# EasyEDA Pro project ProProject_Driver_STM32F405_2023-10-07.epro, board PCB1
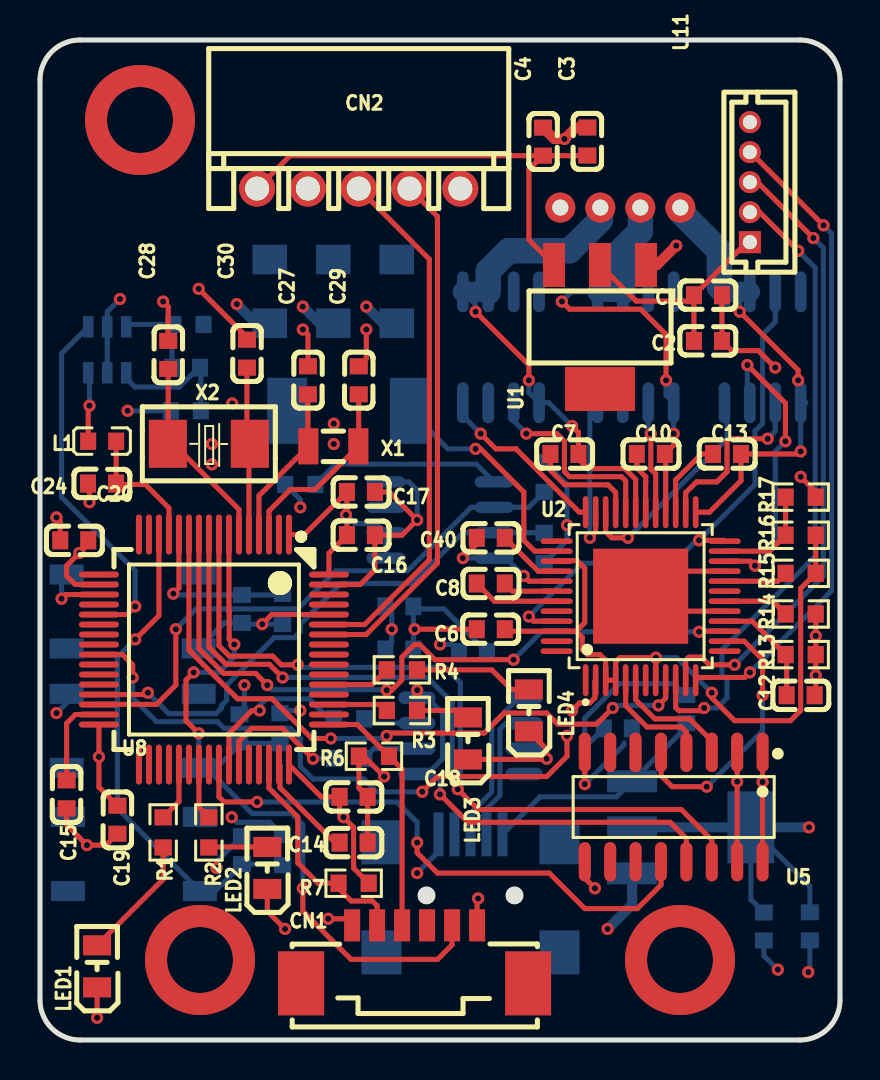
[diagram p4: board, top side]
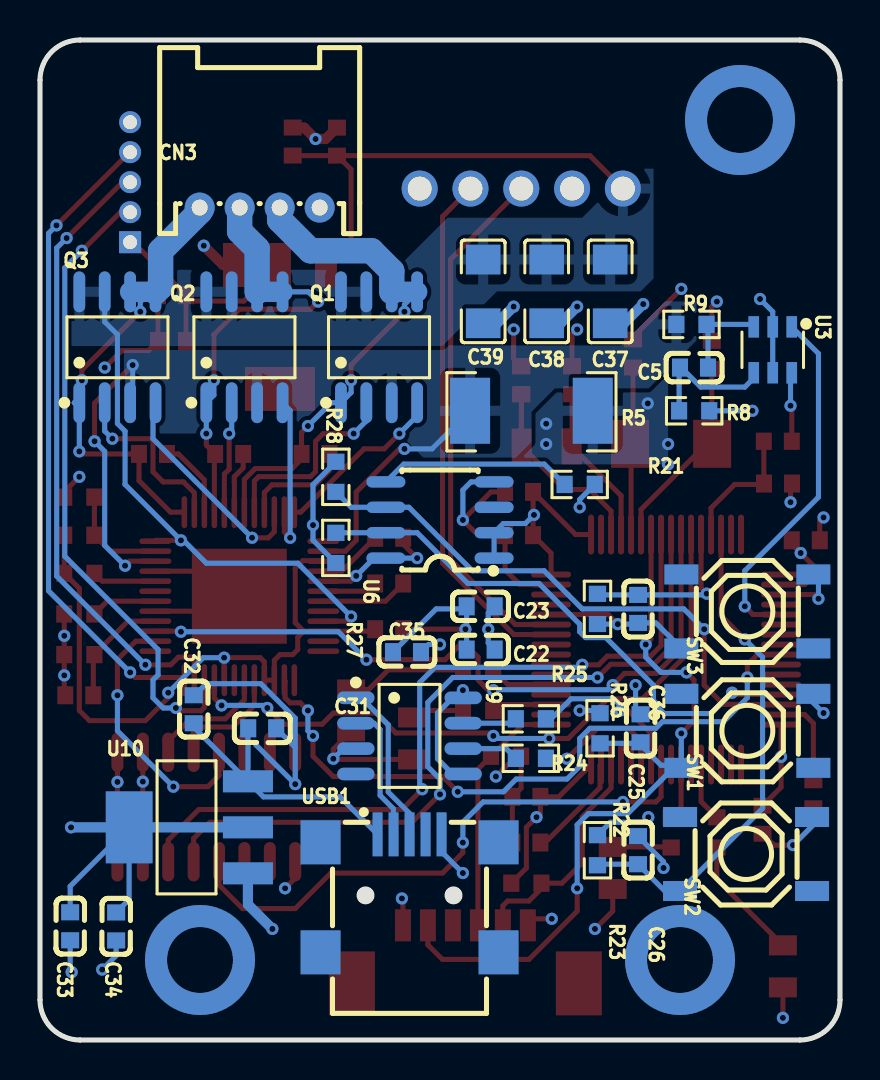
[diagram p5: board, bottom side, seen from below]

Outline 40 x 50 mm; copper layers: Top Layer, Inner1, Inner2, Bottom Layer. Coordinates in mm from the lower left corner of the outline.
Outline path: 0,48 0,2 arc(0.59,0.59) 2,0 38,0 arc(39.41,0.59) 40,2 40,48 arc(39.41,49.41) 38,50 2,50 arc(0.59,49.41) 0,48
Stack: Top Layer 0.035mm / Dielectric1 0.48mm PP er 4.5 / Inner1 0.035mm / Dielectric2 0.48mm FR4 er 4.5 / Inner2 0.035mm / Dielectric3 0.48mm PP er 4.5 / Bottom Layer 0.035mm

## Design rules (mm)
spacing safeClearance (default): track to track 0.152, other pairs 0.152 to 0.3
track width trackWidth (default): min 0.127, default 0.254, max 2.54
differential pair differentialPair (default): width min 0.127, default 0.254, max 2.54; gap min 0.152, default 0.152
via viaSize (default): diameter min 0.5, default 0.61, max 10; hole min 0.3, default 0.305, max 6
net GND uses copperRegion1
net VCC uses copperRegion1
net GND_CS uses copperRegion1
net +16V uses copperRegion1

## Placement (name value [footprint] x y rotation side)
C1  10uF  [C0603]  33.4 37.24 0 top
C2  100nF  [C0603]  33.4 34.95 0 top
C3  10uF  [C0603]  27.37 44.92 270 top
C4  100nF  [C0603]  25.15 44.92 270 top
C5  100nF  [C0603]  7.3 33.62 0 bottom
C6  1uF  [C0603]  22.54 20.54 0 top
C7  33nF  [C0603]  26.22 29.3 180 top
C8  470nF  [C0603]  22.54 22.83 180 top
C10  33nF  [C0603]  30.54 29.3 180 top
C12  1nF  [C0603]  38.03 17.24 180 top
C13  33nF  [C0603]  34.35 29.3 180 top
C14  100nF  [C0603]  15.68 9.87 180 top
C15  100nF  [C0603]  1.33 12.28 90 top
C16  100nF  [C0603]  16.05 25.24 180 top
C17  100nF  [C0603]  16.05 27.4 180 top
C18  100nF  [C0603]  15.68 12.16 180 top
C19  100nF  [C0603]  3.87 11.01 90 top
C20  100nF  [C0603]  1.71 24.98 180 top
C22  10uF  [C0603]  17.97 19.52 180 bottom
C23  100nF  [C0603]  17.97 21.68 180 bottom
C24  100nF  [C0603]  3.1 27.82 0 top
C25  100nF  [C0603]  9.97 15.59 270 bottom
C26  100nF  [C0603]  10.1 9.49 270 bottom
C27  20pF  [C0603]  13.4 32.98 270 top
C28  20pF  [C0603]  6.41 34.25 270 top
C29  20pF  [C0603]  15.94 32.98 270 top
C30  20pF  [C0603]  10.35 34.32 270 top
C31  100nF  [C0603]  28.89 15.59 0 bottom
C32  10uF  [C0603]  32.31 16.54 270 bottom
C33  100nF  [C0603]  38.49 5.69 270 bottom
C34  10uF  [C0603]  36.19 5.68 270 bottom
C35  100nF  [C0603]  21.65 19.4 180 bottom
C36  100nF  [C0603]  10.09 21.56 90 bottom
C37  10uF  [C1206]  11.49 37.43 90 bottom
C38  10uF  [C1206]  14.67 37.43 90 bottom
C39  10uF  [C1206]  17.84 37.43 90 bottom
C40  1uF  [C0603]  22.54 25.11 180 top
CN1  532610671  [CONN-SMD_6P-P1.25_53261-0671]  18.73 4.28 0 top
CN2  5264-5AWD米色  [CONN-TH_5P-P2.50_5264-5AWD]  15.94 43.27 0 top
CN3  HC-HY-4AW  [CONN-TH_4P-P2.00_HCTL_HC-HY-4AW]  29.02 41.62 180 bottom
L1  3.3uH  [L0603]  3.11 29.94 0 top
LED1  SZYY0805B  [LED0805-R-RD_BLUE]  2.85 3.68 90 top
LED2  SZYY0805B  [LED0805-R-RD_BLUE]  11.36 8.6 90 top
LED3  SZYY0805B  [LED0805-R-RD_BLUE]  21.4 15.08 90 top
LED4  SZYY0805B  [LED0805-R-RD_BLUE]  24.44 16.47 90 top
Q1  IRF8313PBF  [SOIC-8_L4.9-W3.9-P1.27-LS6.0-BL]  23.05 34.64 180 bottom
Q2  IRF8313PBF  [SOIC-8_L4.9-W3.9-P1.27-LS6.0-BL]  29.78 34.64 180 bottom
Q3  IRF8313PBF  [SOIC-8_L4.9-W3.9-P1.27-LS6.0-BL]  36.13 34.64 180 bottom
R1  1kΩ  [R0603]  6.16 10.38 90 top
R2  1kΩ  [R0603]  8.44 10.38 90 top
R3  1kΩ  [R0603]  18.09 16.47 180 top
R4  1kΩ  [R0603]  18.09 18.51 180 top
R5  25mΩ  [RES-SMD_L6.4-W3.2-R2512]  15.43 31.46 0 bottom
R6  10kΩ  [R0603]  16.7 14.19 0 top
R7  10kΩ  [R0603]  15.68 7.84 180 top
R8  10Ω  [R0603]  7.29 31.46 180 bottom
R9  10Ω  [R0603]  7.43 35.78 0 bottom
R13  47kΩ  [R0603]  38.03 19.27 180 top
R14  10kΩ  [R0603]  38.03 21.3 0 top
R15  100kΩ  [R0603]  38.03 23.33 180 top
R16  100kΩ  [R0603]  38.03 25.24 180 top
R17  10kΩ  [R0603]  38.03 27.14 180 top
R21  1kΩ  [R0603]  13.01 27.78 0 bottom
R22  10kΩ  [R0603]  12 15.59 90 bottom
R23  10kΩ  [R0603]  12.13 9.49 90 bottom
R24  1kΩ  [R0603]  15.46 14.09 0 bottom
R25  1kΩ  [R0603]  15.46 16.06 0 bottom
R26  10kΩ  [R0603]  12.13 21.56 90 bottom
R27  10kΩ  [R0603]  25.21 24.6 270 bottom
R28  10kΩ  [R0603]  25.21 28.16 90 bottom
SW1  TS-1187A-B-A-B  [SW-SMD_4P-L5.1-W5.1-P3.70-LS6.5-TL-2]  4.63 15.46 0 bottom
SW2  TS-1187A-B-A-B  [SW-SMD_4P-L5.1-W5.1-P3.70-LS6.5-TL-2]  4.7 9.3 0 bottom
SW3  TS-1187A-B-A-B  [SW-SMD_4P-L5.1-W5.1-P3.70-LS6.5-TL-2]  4.63 21.43 180 bottom
U1  AMS1117-5.0  [SOT-223_L6.7-W3.5-P2.30-BR]  28 35.65 90 top
U2  A3930KJPTR-T  [LQFP-48_L7.0-W7.0-P0.50-LS9.0-BL-EP]  30.03 22.19 0 top
U3  INA181A1IDBVR  [SOT-23-6_L2.9-W1.6-P0.95-LS2.8-TL]  3.36 34.51 270 bottom
U5  π131M31  [SOIC-16_L9.9-W3.9-P1.27-LS6.0-BL]  31.68 11.65 180 top
U6  AS5600-ASOT  [SOIC-8_L5.0-W4.0-P1.27-LS6.0-BL]  20 26 90 bottom
U8  STM32F405RGT6  [LQFP-64_L10.0-W10.0-P0.50-LS12.0-BL]  8.7 19.52 180 top
U9  CH340N  [SOP-8_L4.9-W3.9-P1.27-LS6.0-BL]  21.52 15.2 270 bottom
U10  AMS1117-3.3  [SOT-223-3_L6.5-W3.4-P2.30-LS7.0-BR]  32.57 10.63 180 bottom
U11  B5B-ZR-3.4(LF)(SN)  [CONN-TH_B5B-ZR-3.4-LF-SN]  35.49 42.89 270 top
USB1  MINI 5PTP  [MINI-USB-SMD_MINI-5PTP]  21.52 7.33 180 bottom
X1  32.768kHz  [FC-135R_L3.2-W1.5]  14.67 29.68 0 top
X2  8MHz  [CRYSTAL-SMD_L5.0-W3.2]  8.44 29.81 0 top

## Footprints (pads in the part's own frame, mm; a bottom-side part is the same pattern mirrored in y, then rotated)
C0603
  rect 0.8x0.9 smd: 1(-0.7,0) 2(0.7,0)
C1206
  rect 1.485x1.728 smd: 1(-1.593,0) 2(1.593,0)
CONN-SMD_6P-P1.25_53261-0671
  rect 0.8x1.6 smd: 1(3.124,1.45) 2(1.875,1.45) 3(0.625,1.45) 4(-0.625,1.45) 5(-1.875,1.45) 6(-3.124,1.45)
  rect 2.301x3.2 smd: 7(-5.675,-1.45) 8(5.675,-1.45)
CONN-TH_4P-P2.00_HCTL_HC-HY-4AW
  round 1.5 hole 0.8: 1(-3,0) 2(-1,0) 3(1,0) 4(3,0)
CONN-TH_5P-P2.50_5264-5AWD
  round 1.801 hole 1.199: 1(-5.08,-0.701) 2(-2.54,-0.701) 3(0,-0.701) 4(2.54,-0.701) 5(5.08,-0.701)
CONN-TH_B5B-ZR-3.4-LF-SN
  rect 1.1x1.1 hole 0.7: 1(3,0)
  round 1.1 hole 0.7: 2(1.5,0) 3(0,0) 4(-1.5,0) 5(-3,0)
CRYSTAL-SMD_L5.0-W3.2
  rect 1.9x2.4 smd: 1(-2.05,0) 2(2.05,0)
FC-135R_L3.2-W1.5
  rect 1x1.8 smd: 1(-1.25,0) 2(1.25,0)
L0603
  rect 0.8x0.864 smd: 1(-0.7,0) 2(0.7,0)
LED0805-R-RD_BLUE
  rect 1.001x1.399 smd: 1(1.052,0) 2(-1.049,0)
LQFP-48_L7.0-W7.0-P0.50-LS9.0-BL-EP
  oval 0.28x1.6 smd: 1(-2.75,-4.2) 2(-2.25,-4.2) 3(-1.75,-4.2) 4(-1.25,-4.2) 5(-0.75,-4.2) 6(-0.25,-4.2) 7(0.25,-4.2) 8(0.75,-4.2) 9(1.25,-4.2) 10(1.75,-4.2) 11(2.25,-4.2) 12(2.75,-4.2) 25(2.75,4.2) 26(2.25,4.2) 27(1.75,4.2) 28(1.25,4.2) 29(0.75,4.2) 30(0.25,4.2) 31(-0.25,4.2) 32(-0.75,4.2) 33(-1.25,4.2) 34(-1.75,4.2) 35(-2.25,4.2) 36(-2.75,4.2)
  oval 1.6x0.28 smd: 13(4.2,-2.75) 14(4.2,-2.25) 15(4.2,-1.75) 16(4.2,-1.25) 17(4.2,-0.75) 18(4.2,-0.25) 19(4.2,0.25) 20(4.2,0.75) 21(4.2,1.25) 22(4.2,1.75) 23(4.2,2.25) 24(4.2,2.75) 37(-4.2,2.75) 38(-4.2,2.25) 39(-4.2,1.75) 40(-4.2,1.25) 41(-4.2,0.75) 42(-4.2,0.25) 43(-4.2,-0.25) 44(-4.2,-0.75) 45(-4.2,-1.25) 46(-4.2,-1.75) 47(-4.2,-2.25) 48(-4.2,-2.75)
  rect 4.75x4.75 smd: 49(0,0)
LQFP-64_L10.0-W10.0-P0.50-LS12.0-BL
  oval 0.3x2 smd: 1(-3.75,-5.75) 2(-3.25,-5.75) 3(-2.75,-5.75) 4(-2.25,-5.75) 5(-1.75,-5.75) 6(-1.25,-5.75) 7(-0.75,-5.75) 8(-0.25,-5.75) 9(0.25,-5.75) 10(0.75,-5.75) 11(1.25,-5.75) 12(1.75,-5.75) 13(2.25,-5.75) 14(2.75,-5.75) 15(3.25,-5.75) 16(3.75,-5.75) 33(3.75,5.75) 34(3.25,5.75) 35(2.75,5.75) 36(2.25,5.75) 37(1.75,5.75) 38(1.25,5.75) 39(0.75,5.75) 40(0.25,5.75) 41(-0.25,5.75) 42(-0.75,5.75) 43(-1.25,5.75) 44(-1.75,5.75) 45(-2.25,5.75) 46(-2.75,5.75) 47(-3.25,5.75) 48(-3.75,5.75)
  oval 2x0.3 smd: 17(5.75,-3.75) 18(5.75,-3.25) 19(5.75,-2.75) 20(5.75,-2.25) 21(5.75,-1.75) 22(5.75,-1.25) 23(5.75,-0.75) 24(5.75,-0.25) 25(5.75,0.25) 26(5.75,0.75) 27(5.75,1.25) 28(5.75,1.75) 29(5.75,2.25) 30(5.75,2.75) 31(5.75,3.25) 32(5.75,3.75) 49(-5.75,3.75) 50(-5.75,3.25) 51(-5.75,2.75) 52(-5.75,2.25) 53(-5.75,1.75) 54(-5.75,1.25) 55(-5.75,0.75) 56(-5.75,0.25) 57(-5.75,-0.25) 58(-5.75,-0.75) 59(-5.75,-1.25) 60(-5.75,-1.75) 61(-5.75,-2.25) 62(-5.75,-2.75) 63(-5.75,-3.25) 64(-5.75,-3.75)
MINI-USB-SMD_MINI-5PTP
  rect 0.5x2.2 smd: 1(-1.6,2.95) 2(-0.8,2.95) 3(0,2.95) 4(0.8,2.95) 5(1.6,2.95)
  rect 2x2.2 smd: 6(-4.45,2.55) 7(4.45,2.55) 8(4.45,-2.95) 9(-4.45,-2.95)
R0603
  rect 0.806x0.864 smd: 1(-0.753,0) 2(0.753,0)
RES-SMD_L6.4-W3.2-R2512
  rect 2x3.3 smd: 1(-3.067,0) 2(3.067,0)
SOIC-8_L4.9-W3.9-P1.27-LS6.0-BL
  oval 0.588x2.045 smd: 1(-1.905,-2.772) 2(-0.635,-2.772) 3(0.635,-2.772) 4(1.905,-2.772) 5(1.905,2.772) 6(0.635,2.772) 7(-0.635,2.772) 8(-1.905,2.772)
SOIC-8_L5.0-W4.0-P1.27-LS6.0-BL
  oval 0.569x1.95 smd: 1(-1.905,-2.705) 2(-0.635,-2.705) 3(0.635,-2.705) 4(1.905,-2.705) 5(1.905,2.705) 6(0.635,2.705) 7(-0.635,2.705) 8(-1.905,2.705)
SOIC-16_L9.9-W3.9-P1.27-LS6.0-BL
  oval 0.602x1.971 smd: 1(-4.445,-2.736) 2(-3.175,-2.736) 3(-1.905,-2.736) 4(-0.635,-2.736) 5(0.635,-2.736) 6(1.905,-2.736) 7(3.175,-2.736) 8(4.445,-2.736) 9(4.445,2.736) 10(3.175,2.736) 11(1.905,2.736) 12(0.635,2.736) 13(-0.635,2.736) 14(-1.905,2.736) 15(-3.175,2.736) 16(-4.445,2.736)
SOP-8_L4.9-W3.9-P1.27-LS6.0-BL
  oval 0.63x1.865 smd: 1(-1.905,-2.683) 2(-0.635,-2.683) 3(0.635,-2.683) 4(1.905,-2.683) 5(1.905,2.683) 6(0.635,2.683) 7(-0.635,2.683) 8(-1.905,2.683)
SOT-23-6_L2.9-W1.6-P0.95-LS2.8-TL
  rect 1.072x0.531 smd: 1(-1.148,0.95) 2(-1.148,0) 3(-1.148,-0.95) 4(1.148,-0.95) 5(1.148,0) 6(1.148,0.95)
SOT-223-3_L6.5-W3.4-P2.30-LS7.0-BR
  rect 2.5x1.1 smd: 1(2.97,-2.3) 2(2.97,0) 3(2.97,2.3)
  rect 2.34x3.6 smd: 4(-2.97,0)
SOT-223_L6.7-W3.5-P2.30-BR
  rect 2.2x1.1 smd: 1(3.099,-2.3) 2(3.099,0) 3(3.099,2.3)
  rect 2.2x3.5 smd: 4(-3.099,0)
SW-SMD_4P-L5.1-W5.1-P3.70-LS6.5-TL-2
  rect 1.7x1 smd: 1(-3.3,1.85) 2(3.3,1.85) 3(-3.3,-1.85) 4(3.3,-1.85)

## Nets
As in the schematic.

Pads without a net: CN1 3 7 8; CN3 4; SW1 1 4; SW2 1 4; SW3 1 4; U1 4; U2 1 7 13 19 37 44 47 48; U5 6 7 10 11; U6 3; U8 2 16 20 22 23 24 26 27 33 34 35 36 38 40 44 45 50 52 54 55 56 57 61 62; U9 4; USB1 4 6 7 8 9

## Via types
v1: diameter 5.5, hole 3.3, Top Layer to Bottom Layer, 3 vias
v2: diameter 0.61, hole 0.305, Top Layer to Bottom Layer, 119 vias

## Routing (per net, layer and track width the routed paths; a pad name or vN(x,y) marks a point on that pad's centre or on a via; arc(x,y) is an arc through that point)
+5V: length 11.7
  Top Layer w0.254: C1.1 C2.1 ; C1.1 32.41,36.95 29.8,36.95 U1.2 ; C1.1 35.35,39.89 U11.1
+5V_USB: length 14.3
  Bottom Layer w0.254: C31.2 29.6,15.57 U10.3 ; USB1.1 25,12.16 28.83,12.16 U10.3 ; U10.3 32.32,15.65 32.32,15.83 C32.2
+16V: length 50.3
  Top Layer w0.254: 25.14,44.22 24.44,43.53 24.44,40.01 U1.3 ; 25.14,44.22 12.5,44.22 CN2.1 ; 25.14,44.22 C4.2 27.36,44.22 C3.2 ; v2(24.44,21.17) 24.68,20.94 U2.45 ; U2.24 34.19,24.98 v2(32.95,24.98)
  Bottom Layer w0.254: Q3.7 36.76,35.91 36.13,35.27 36.13,30.83 35.75,30.44 35.75,27.78 v2(32.95,24.98) 32.83,24.98 31.68,23.84 27.11,23.84 v2(24.44,21.17)
GND: length 149.3
  Top Layer w0.254: v2(27.75,7.58) 27.24,8.09 U5.9 ; C30.1 10.35,35.14 v2(7.94,37.56) ; LED2.2 11.36,6.44 v2(12.25,5.55) ; v2(38.03,28.16) 38.79,27.41 R17.1 ; U8.63 16.01,22.77 16.75,23.51 C16.1 18.1,25.24 v2(18.86,26) 17.45,27.4 C17.1 ; v2(6.66,22.32) 6.95,22.6 U8.12 ; U2.41 24.46,22.94 v2(24.19,23.21) ; v2(18.73,20.54) C6.1 ; C20.1 2.41,24.8 v2(1.97,24.35) 1.33,23.71 1.33,23.21 1.76,22.77 U8.18 ; C15.1 1.33,10.76 v2(2.35,9.74) 3.3,9.74 C19.1 ; LED4.2 25.33,14.54 v2(25.33,14.06) 25.3,14.03 LED3.2 ; 30.53,22.69 31.28,23.44 U2.21 ; U2.17 30.78,21.44 30.53,21.69 ; v2(16.32,35.53) 16.32,34.07 C29.1 ; LED1.2 v2(2.85,1.11) ; v2(2.47,26.89) 2.47,27.75 C24.1 ; C40.2 21.84,24.79 v2(21.14,24.09) ; v2(36.76,33.62) 35.91,34.47 34.58,34.47 C2.2 C1.2 ; U5.15 v2(34.86,12.92) U5.2 ; CN1.6 15.28,6.06 v2(14.41,6.06) ; v2(17.21,13.17) 16.19,14.19 R6.1 15.94,12.59 C18.1 C14.1 ; C28.1 6.41,36.67 v2(6.16,36.92) ; C27.1 13.4,35.27 v2(13.14,35.53) ; U5.8 v2(27.24,12.79) ; R14.2 v2(38.79,20.21) R13.1 v2(38.79,18.23) 38.79,17.29 C12.1
  Top Layer w0.508: v2(31.81,39.72) 30.85,38.75 30.3,38.75 ; C4.1 25.72,45.05 v2(26.22,45.05) 26.8,45.62 C3.1
  Bottom Layer w0.254: 27.24,14.64 v2(27.24,12.79) 29.2,14.75 29.2,14.86 ; 27.24,14.64 C31.1 ; 27.24,14.64 27.24,16.09 28.96,17.82 31.69,17.82 32.26,17.24 C32.1 ; v2(2.35,9.74) 1.4,10.69 SW2.3 ; R26.2 12.07,22.25 C36.2 6.73,22.25 v2(6.66,22.32) ; v2(24.19,23.21) 23.3,24.09 U6.8 v2(21.14,24.09) ; C34.2 36.19,4.22 v2(36.89,3.52) ; U9.3 24.83,14.57 v2(25.33,14.06) ; C33.2 38.49,3.47 v2(38.41,3.39) ; USB1.5 19.92,9.41 v2(18.86,8.35) ; C35.1 20.19,21.56 18.79,21.56 C23.1 18.67,20.6 v2(18.73,20.54) 18.67,20.48 C22.1 ; v2(13.01,26.64) 13.01,27.02 R21.1 ; C26.1 8.82,8.91 v2(8.82,8.6) ; v2(4,37.05) 3.36,36.41 U3.2 U3.5 ; U6.4 18.45,27.91 18.86,27.5 v2(18.86,26) ; C25.1 10.22,16.53 v2(10.22,17.75) ; v2(0.82,16.35) 1.33,16.86 1.33,17.44 ; R8.2 v2(4.38,31.46)
  Bottom Layer w0.508: C39.1 17.15,35.84 v2(16.32,36.67) ; v2(13.14,36.67) 13.97,35.84 C38.1 ; U10.1 29.6,6.77 v2(28.38,5.55) ; v2(9.84,36.8) 10.8,35.84 C37.1
  vias: v2(8.6,29.8) v2(8.6,28.78) v2(9.61,31.83) v2(14.69,30.81) v2(14.69,29.8)
GND_CS: length 26.7
  Top Layer w0.254: v2(37.27,29.94) 37.27,31.84 v2(35.37,33.75) ; U2.38 24.74,24.44 24.19,24.98 24.19,27.4 22.03,29.56 v2(21.78,29.56) ; U2.22 35.52,23.94 v2(35.75,23.71)
  Bottom Layer w0.254: v2(21.78,29.56) 20.4,29.56 R5.2 ; v2(35.75,23.71) 36.76,24.73 36.76,29.43 v2(37.27,29.94) ; v2(35.37,33.75) 35.37,31.99 Q3.3
VCC: length 77.6
  Top Layer w0.254: U5.16 v2(36.13,12.9) U5.1 ; CN1.1 21.85,7.03 v2(21.91,7.08) ; v2(1.08,22.06) 1.29,22.27 U8.19 ; R7.1 15.68,8.59 15.68,10.63 14.98,11.33 C18.2 14.06,12.16 U8.48 ; C19.2 2.95,12.64 v2(2.95,14.16) U8.32 ; U8.1 13.22,25.27 C17.2 15.35,26.3 v2(15.3,26.25) 15.35,26.21 C16.2 14.45,24.34 U8.64 ; v2(0.82,26.13) 1.01,25.94 C20.2 ; v2(2.47,31.72) 2.41,31.65 2.41,29.94
  Bottom Layer w0.254: v2(2.47,31.72) 2.47,33.3 U3.6 ; v2(15.3,26.25) 15.73,25.82 16.84,25.82 U6.2 U6.1 ; v2(9.59,11.14) 9.84,10.89 11.48,10.89 R23.2 ; C23.2 17.59,21.36 v2(17.59,20.54) 17.59,19.84 C22.2 ; U9.5 19.37,13.3 20.13,14.06 20.13,16.35 19.37,17.11 U9.8 18.86,17.13 v2(18.86,17.49) ; v2(1.08,22.06) 1.08,23.02 SW3.2 ; R27.2 26.35,24.99 v2(26.35,25.75) 26.35,27.77 R28.2 ; C35.2 20.57,19.78 v2(20,19.78) ; C33.1 38.49,7.68 U10.4 35.54,7.03 C34.1 ; R22.2 12.13,16.47 v2(13.01,16.47)
  Bottom Layer w0.508: v2(38.45,10.63) U10.4 U10.2
  vias: v2(15.17,11.14)
VDDA: length 6.6
  Top Layer w0.254: U8.13 6.45,26.6 5.27,27.78 3.85,27.78 C24.2 3.81,27.83 L1.2
(no net):
  vias: v1(5,46) v1(8,4) v1(32,4)
A_OUT: length 25.3
  Top Layer w0.254: v2(21.78,36.41) 24.44,33.75 v2(24.44,32.98) ; v2(26.6,30.7) 26.92,30.38 C7.1 ; U2.31 29.78,28.03 29.24,28.57 27.4,28.57 26.92,29.05
  Bottom Layer w0.254: v2(24.44,32.98) 24.44,32.37 Q1.1 25.44,31.86 v2(26.6,30.7) ; Q1.5 21.78,36.77 v2(21.78,36.41)
  Bottom Layer w1.016: Q1.6 Q1.5
  Bottom Layer w1.27: CN3.3 28.02,41 26.48,39.46 23.43,39.46 22.41,38.45 Q1.6
B_OUT: length 23
  Top Layer w0.254: U2.28 31.28,29.26 C10.1 31.68,29.75 v2(31.68,30.32) ; v2(26.1,36.92) 26.48,36.54 30.03,36.54 31.3,35.27 v2(31.3,32.98)
  Bottom Layer w0.254: v2(31.68,30.32) Q2.1 31.3,32.24 v2(31.3,32.98) ; v2(26.1,36.92) 26.58,37.41 Q2.5
  Bottom Layer w1.016: Q2.6 Q2.5
  Bottom Layer w1.27: Q2.6 29.14,39.56 30.02,40.44 CN3.2
BOOT0: length 8.3
  Top Layer w0.254: U8.60 11.59,21.27 v2(11.11,20.79)
  Bottom Layer w0.254: R26.1 12.12,20.79 v2(11.11,20.79) 10.16,20.79 C36.1 9.21,20.86 7.93,19.58
C_OUT: length 23.2
  Top Layer w0.254: U2.25 33.47,26.39 35.05,27.97 C13.1 37.91,29.3 v2(38.03,29.43) ; v2(37.91,32.98) 37.91,33.49 v2(34.99,36.41)
  Bottom Layer w0.254: 34.48,37.41 34.99,36.9 v2(34.99,36.41) ; v2(38.03,29.43) 38.03,31.61 38.29,31.86 37.91,32.24 v2(37.91,32.98)
  Bottom Layer w1.016: Q3.6 34.35,37.41
  Bottom Layer w1.27: CN3.1 32.02,41.41 33.97,39.46 33.97,37.66 Q3.5
CA: length 5.5
  Top Layer w0.254: U2.33 28.78,27.38 28.4,27.76 26.24,27.76 25.52,28.48 C7.2
CB: length 3.1
  Top Layer w0.254: U2.30 30.28,27.9 30.29,27.91 30.29,28.16 29.84,28.61 C10.2
CC: length 4
  Top Layer w0.254: U2.27 31.78,28 33.08,29.3 C13.2
D+: length 8.1
  Bottom Layer w0.254: U9.1 23.94,17.11 22.59,15.76 22.59,12.4 21.52,11.33 USB1.3
D-: length 6.9
  Bottom Layer w0.254: USB1.2 22.32,11.56 22.99,12.23 22.99,15.53 23.3,15.84 U9.2
DIR: length 33.8
  Top Layer w0.254: v2(17.33,15.2) 17.48,15.35 22.21,15.35 23.21,16.35 25.33,16.35 25.89,15.79 27.82,15.79 v2(28.64,16.6) ; v2(14.54,15.08) 13.59,15.08 11.6,17.06 9.88,17.06 7.54,19.4 7.61,19.34 7.45,19.5 U8.11 ; U2.9 31.28,17.09 v2(30.92,16.73)
  Bottom Layer w0.254: v2(14.54,15.08) 17.21,15.08 v2(17.33,15.2) ; v2(28.64,16.6) 28.76,16.73 v2(30.92,16.73)
FF1: length 38.6
  Top Layer w0.254: v2(12.89,18.76) 12.07,18.76 11.63,19.19 9.47,19.19 8.95,19.72 U8.8 ; U5.14 33.59,10 32.06,11.52 21.91,11.52 v2(20.89,12.54)
  Bottom Layer w0.254: v2(20.89,12.54) 21.02,12.67 21.02,17.87 20.25,18.63 13.01,18.63 v2(12.89,18.76)
FF1_V: length 6.2
  Top Layer w0.254: U5.3 33.59,14.95 32.48,16.06 30.74,16.06 29.78,17.01 U2.6
FF2: length 38.2
  Top Layer w0.254: v2(20,12.28) 21.4,10.89 31.51,10.89 32.32,10.08 U5.13 ; v2(12.13,18.13) 11.47,18.79 9.3,18.79 8.45,19.64 U8.9
  Bottom Layer w0.254: v2(12.13,18.13) 19.37,18.13 20.61,16.88 20.61,13.66 20,13.05 v2(20,12.28)
FF2_V: length 5.9
  Top Layer w0.254: U2.5 29.28,16.72 30.35,15.65 32.06,15.65 32.32,15.4 U5.4
GHA: length 10.2
  Top Layer w0.254: v2(24.32,30.32) 25.84,30.32 26.22,29.94 26.22,28.42 26.48,28.17 29.07,28.17 29.28,27.95 U2.32
  Bottom Layer w0.254: Q1.2 23.68,30.95 v2(24.32,30.32)
GHB: length 5.6
  Top Layer w0.254: U2.29 30.78,28.3 30.54,28.54 v2(30.54,30.32)
  Bottom Layer w0.254: v2(30.54,30.32) 30.41,30.44 Q2.2
GHC: length 8.8
  Top Layer w0.254: U2.26 32.28,27.36 32.83,27.91 33.84,27.91 34.35,28.41 34.35,29.94 34.48,30.06 v2(36.38,30.06)
  Bottom Layer w0.254: v2(36.38,30.06) 36.76,30.44 36.76,31.61
GLA: length 8.8
  Top Layer w0.254: v2(22.03,30.32) 22.79,29.56 23.81,29.56 23.81,29.55 26.97,26.39 U2.36
  Bottom Layer w0.254: Q1.4 21.14,31.21 v2(22.03,30.32)
GLB: length 8.3
  Top Layer w0.254: U2.35 27.78,25.4 v2(27.49,25.11)
  Bottom Layer w0.254: Q2.4 27.49,31.48 v2(27.49,25.11)
GLC: length 10.9
  Top Layer w0.254: v2(29.4,25.11) 28.58,25.11 28.28,25.41 U2.34
  Bottom Layer w0.254: v2(29.4,25.11) 34.35,30.06 34.35,31.74
HA: length 32.2
  Top Layer w0.254: v2(37.91,39.46) 35.98,41.39 U11.2 ; U2.10 31.78,16.63 31.95,16.46 33.07,16.46 v2(33.21,16.6)
  Bottom Layer w0.254: v2(33.21,16.6) 33.84,16.6 34.35,17.11 34.35,18 34.1,18.25 34.1,19.52 38.76,24.19 38.76,38.61 v2(37.91,39.46)
HB: length 31.4
  Top Layer w0.254: U2.11 32.28,18.98 32.45,19.14 33.08,19.14 33.46,18.76 v2(34.73,18.76) ; U11.3 35.88,42.89 v2(38.67,40.1)
  Bottom Layer w0.254: v2(38.67,40.1) 39.17,39.6 39.17,23.2 v2(34.73,18.76)
HC: length 32.3
  Top Layer w0.254: U2.12 32.92,18.13 35.24,18.13 v2(35.49,18.38) ; v2(39.18,40.73) 35.52,44.39 U11.4
  Bottom Layer w0.254: v2(39.18,40.73) 39.57,40.34 39.57,22.46 v2(35.49,18.38)
I2C1_SCL: length 26.2
  Top Layer w0.254: CN2.4 19.87,41.17 19.87,23.84 16.31,20.27 U8.58
I2C1_SDA: length 26.4
  Top Layer w0.254: CN2.3 19.47,39.04 19.47,24.01 16.23,20.77 U8.59
I2C2_SCL: length 27.2
  Top Layer w0.254: U8.29 5.3,17.27 v2(5.4,17.36)
  Bottom Layer w0.254: R27.1 25.2,25.36 U6.7 21.14,25.36 18.6,22.83 15.05,22.83 13.01,20.79 13.01,20.41 12.72,20.12 11.71,20.12 9.33,17.75 9.33,16.98 9.08,16.73 9.08,16.6 8.8,16.32 6.44,16.32 v2(5.4,17.36)
I2C2_SDA: length 28.3
  Top Layer w0.254: U8.30 2.95,16.78 5.83,16.78 6.79,17.75 v2(6.79,20.54)
  Bottom Layer w0.254: v2(6.79,20.54) 7.81,21.56 12.89,21.56 14.79,23.46 18.38,23.46 21.55,26.64 U6.6 24.44,26.64 R28.1
LED1: length 3
  Top Layer w0.254: U8.37 6.95,11.92 R1.2
LED2: length 2.8
  Top Layer w0.254: R2.2 7.95,11.63 U8.39
LED3: length 3
  Top Layer w0.254: R3.2 17.04,16.77 U8.51
LED4: length 3.2
  Top Layer w0.254: R4.2 16.61,17.77 U8.53
MOTOR_CUR: length 18
  Top Layer w0.254: v2(4.76,21.68) 4.35,21.27 U8.21
  Bottom Layer w0.254: v2(4.76,21.68) 4.76,23.46 1.08,27.14 1.08,34.32 U3.1
MOTOR_MODE: length 35.4
  Top Layer w0.254: v2(23.68,19.02) 19.75,19.02 18.98,19.78 18.73,19.78 18.09,19.14 18.09,18 17.59,17.49 v2(17.33,17.49) ; v2(11.36,17.75) 10.78,18.33 9.18,18.33 7.95,19.57 U8.10 ; U2.15 32.98,20.44 v2(32.95,20.41)
  Bottom Layer w0.254: v2(17.33,17.49) 17.31,17.52 11.59,17.52 v2(11.36,17.75) ; v2(23.68,19.02) 25.08,20.41 v2(32.95,20.41)
MOTOR_RESET: length 33.5
  Top Layer w0.254: v2(26.35,15.2) 26.35,14.19 25.33,13.17 19.87,13.17 v2(19.11,12.41) ; v2(26.6,16.47) 26.99,16.86 27.49,16.86 27.75,17.11 27.75,17.95 U2.2 ; U8.25 4.12,19.27 4.63,18.77 v2(4.63,18.13)
  Bottom Layer w0.254: v2(26.35,15.2) 26.6,15.46 v2(26.6,16.47) ; v2(4.63,18.13) 4.63,17.11 5.83,15.92 8.87,15.92 9.21,15.59 12.51,15.59 13.01,15.08 13.01,13.68 13.65,13.05 16.19,13.05 16.82,12.41 v2(19.11,12.41)
NRST: length 38.6
  Top Layer w0.254: v2(13.14,7.58) 13.14,6.44 15.56,4.03 19.88,4.03 20.6,4.76 CN1.2 ; v2(7.94,15.33) 7.3,15.97 7.3,18 v2(7.68,18.38) ; U8.7 9.45,21.44 9.46,21.43 9.46,20.03 v2(9.71,19.78)
  Bottom Layer w0.254: v2(7.68,18.38) 8.95,18.38 9.71,19.14 v2(9.71,19.78) ; 8.2,13.74 7.93,13.74 7.93,15.33 v2(7.94,15.33) ; 8.2,13.74 8.95,13.74 10.1,14.89 10.15,14.83 12.13,14.83 ; 8.2,13.74 10.61,11.32 12.58,11.32 13.14,10.76 v2(13.14,7.58)
OSC32_IN: length 9.6
  Top Layer w0.254: U8.3 11.45,26.45 12.52,27.52 13.76,27.52 X1.2 15.94,29.7 C29.2
OSC32_OUT: length 8
  Top Layer w0.254: C27.2 13.4,29.7 X1.1 10.95,27.21 U8.4
OSC_IN: length 8.4
  Top Layer w0.254: C30.2 10.35,29.95 10.49,29.81 10.45,29.76 U8.5
OSC_OUT: length 9.9
  Top Layer w0.254: 6.41,33.56 6.41,29.83 X2.1 6.66,29.81 9.95,26.53 U8.6
PWM: length 28.6
  Top Layer w0.254: v2(10.86,11.9) 9.21,11.9 8.95,12.16 U8.41 ; U5.12 31.05,7.75 29.87,6.57 27.24,6.57 25.46,8.35 19.87,8.35 18.86,9.36 v2(18.86,9.87)
  Bottom Layer w0.254: v2(18.86,9.87) 18.86,10.89 17.84,11.9 v2(10.86,11.9)
PWM_V: length 13.5
  Top Layer w0.254: U2.14 35.21,19.94 36.13,19.02 v2(36.13,17.24) ; U5.5 31.05,13.22 31.61,12.67 v2(33.34,12.67)
  Bottom Layer w0.254: v2(36.13,17.24) 36.13,15.46 v2(33.34,12.67)
SWCLK: length 12.4
  Top Layer w0.254: U8.49 15.87,15.77 R6.2 18.1,13.53 CN1.4
SWDIO: length 11.5
  Top Layer w0.254: CN1.5 16.86,6.71 16.62,6.95 15.56,6.95 14.93,7.58 R7.2 13.9,7.84 12.89,8.86 12.89,11.15 11.45,12.6 U8.46
USART1_RX: length 6.8
  Top Layer w0.254: v2(13.65,14.06) 12.13,15.59 10.58,15.59 9.95,14.95 U8.43
  Bottom Layer w0.254: v2(13.65,14.06) 13.67,14.09 R24.1
USART1_TX: length 8.1
  Top Layer w0.254: U8.42 9.45,15.32 10.6,16.47 v2(10.98,16.47)
  Bottom Layer w0.254: R25.1 14.45,16.06 13.45,17.06 11.31,17.06 10.98,16.73 v2(10.98,16.47)
WAKE: length 25.2
  Top Layer w0.254: U8.14 5.95,21.22 v2(4.76,20.03)
  Bottom Layer w0.254: v2(4.76,20.03) 3.87,19.14 3.87,11.58 SW2.2 8.76,7.45 C26.2 11.95,8.79 12.13,8.61
$1N4505: length 5.3
  Top Layer w0.254: U8.47 12,13.72 12,12.62 14.75,9.87 C14.2
$1N4511: length 4.6
  Top Layer w0.254: C15.2 1.33,15.83 1.77,16.27 U8.31
$1N14634: length 6.7
  Bottom Layer w0.254: U3.4 4.31,33.09 4.76,32.65 6.96,32.65 7.94,33.62 C5.2 8.04,33.58 8.04,31.46
$1N14640: length 4.6
  Bottom Layer w0.254: C5.1 6.6,35.71 R9.1 4.44,35.78 U3.3
$1N21748: length 2.8
  Top Layer w0.254: U2.42 23.62,22.44 C8.1
$1N21864: length 4.4
  Top Layer w0.254: U2.43 22.72,21.94 C8.2
$1N22637: length 5.8
  Top Layer w0.254: C12.2 37.33,19.22 R13.2 35.61,20.94 U2.16
$1N23232: length 3.3
  Top Layer w0.254: C40.1 24.91,23.44 U2.40
$1N23481: length 34.4
  Top Layer w0.254: 26.81,20.44 U2.46 23.34,20.44 C6.2 ; 26.81,20.44 27.11,20.14 27.11,19.52 27.37,19.27 28,19.27 28.28,18.99 U2.3 U2.4 28.78,18.91 28.99,19.12 30.57,19.12 30.79,18.89 30.79,18 U2.8 ; 26.81,20.44 27.24,20.87 27.24,23.59 26.86,23.97 25.86,23.97 U2.39 ; v2(33.59,17.36) 33.59,17.11 34.73,15.97 37.53,15.97 38.03,16.47 38.03,22.58 R15.1 R16.1
  Bottom Layer w0.254: v2(33.59,17.36) 31.84,19.12 v2(30.79,19.12)
$1N24997: length 3.2
  Top Layer w0.254: U2.20 36.89,22.94 R15.2
$1N25176: length 5.3
  Top Layer w0.254: R17.2 R16.2 36.48,24.44 U2.23
$1N27489: length 3.3
  Top Layer w0.254: U2.18 36.64,21.94 R14.1
$1N33277: length 9.7
  Bottom Layer w0.254: R21.2 14.78,28.79 21.82,28.79 U6.5
$1N35265: length 6.3
  Top Layer w0.254: LED1.1 6.16,8.03 R1.1
$1N35679: length 2.9
  Top Layer w0.254: R2.1 8.47,9.65 LED2.1
$1N35970: length 2.7
  Top Layer w0.254: LED3.1 21.05,16.47 R3.1
$1N38182: length 6
  Top Layer w0.254: LED4.1 23.57,17.53 22.59,18.51 R4.1
$1N41619: length 2.8
  Bottom Layer w0.254: R24.2 16.69,14.57 U9.6
$1N41797: length 2.7
  Bottom Layer w0.254: R25.2 16.43,15.84 U9.7

## Copper pours and planes (outline as drawn; the poured copper is in the pictures)
+16V on Bottom Layer: 9.32,43.57 9.32,38.08 9.97,37.43 17.15,37.43 19.87,34.7 38.44,34.7 39.43,35.7 39.43,38.51 22.22,38.51 19.62,41.11 12.89,41.11 12.13,41.88 12.13,43.38 11.94,43.57
GND on Bottom Layer: 8.6,33.52 16.41,33.52 16.41,28.78 8.6,28.78
GND on Inner1: 0.06,50.89 44.64,50.89 44.64,-2.45 0.06,-2.45
GND_CS on Bottom Layer: 7.17,36.92 7.17,34.98 9.57,32.58 14.25,32.58 15.43,31.41 15.43,29.88 16.52,28.79 20.51,28.79 22.03,30.32 35.62,30.32 36.13,30.83 36.13,34.73 10.95,34.73 8.75,36.92
VCC on Inner2: -2.22,50.77 41.46,50.77 41.46,-0.29 -2.22,-0.29
